# EAGLE design d150_zm1000_rev_a (EAGLE 6.1)
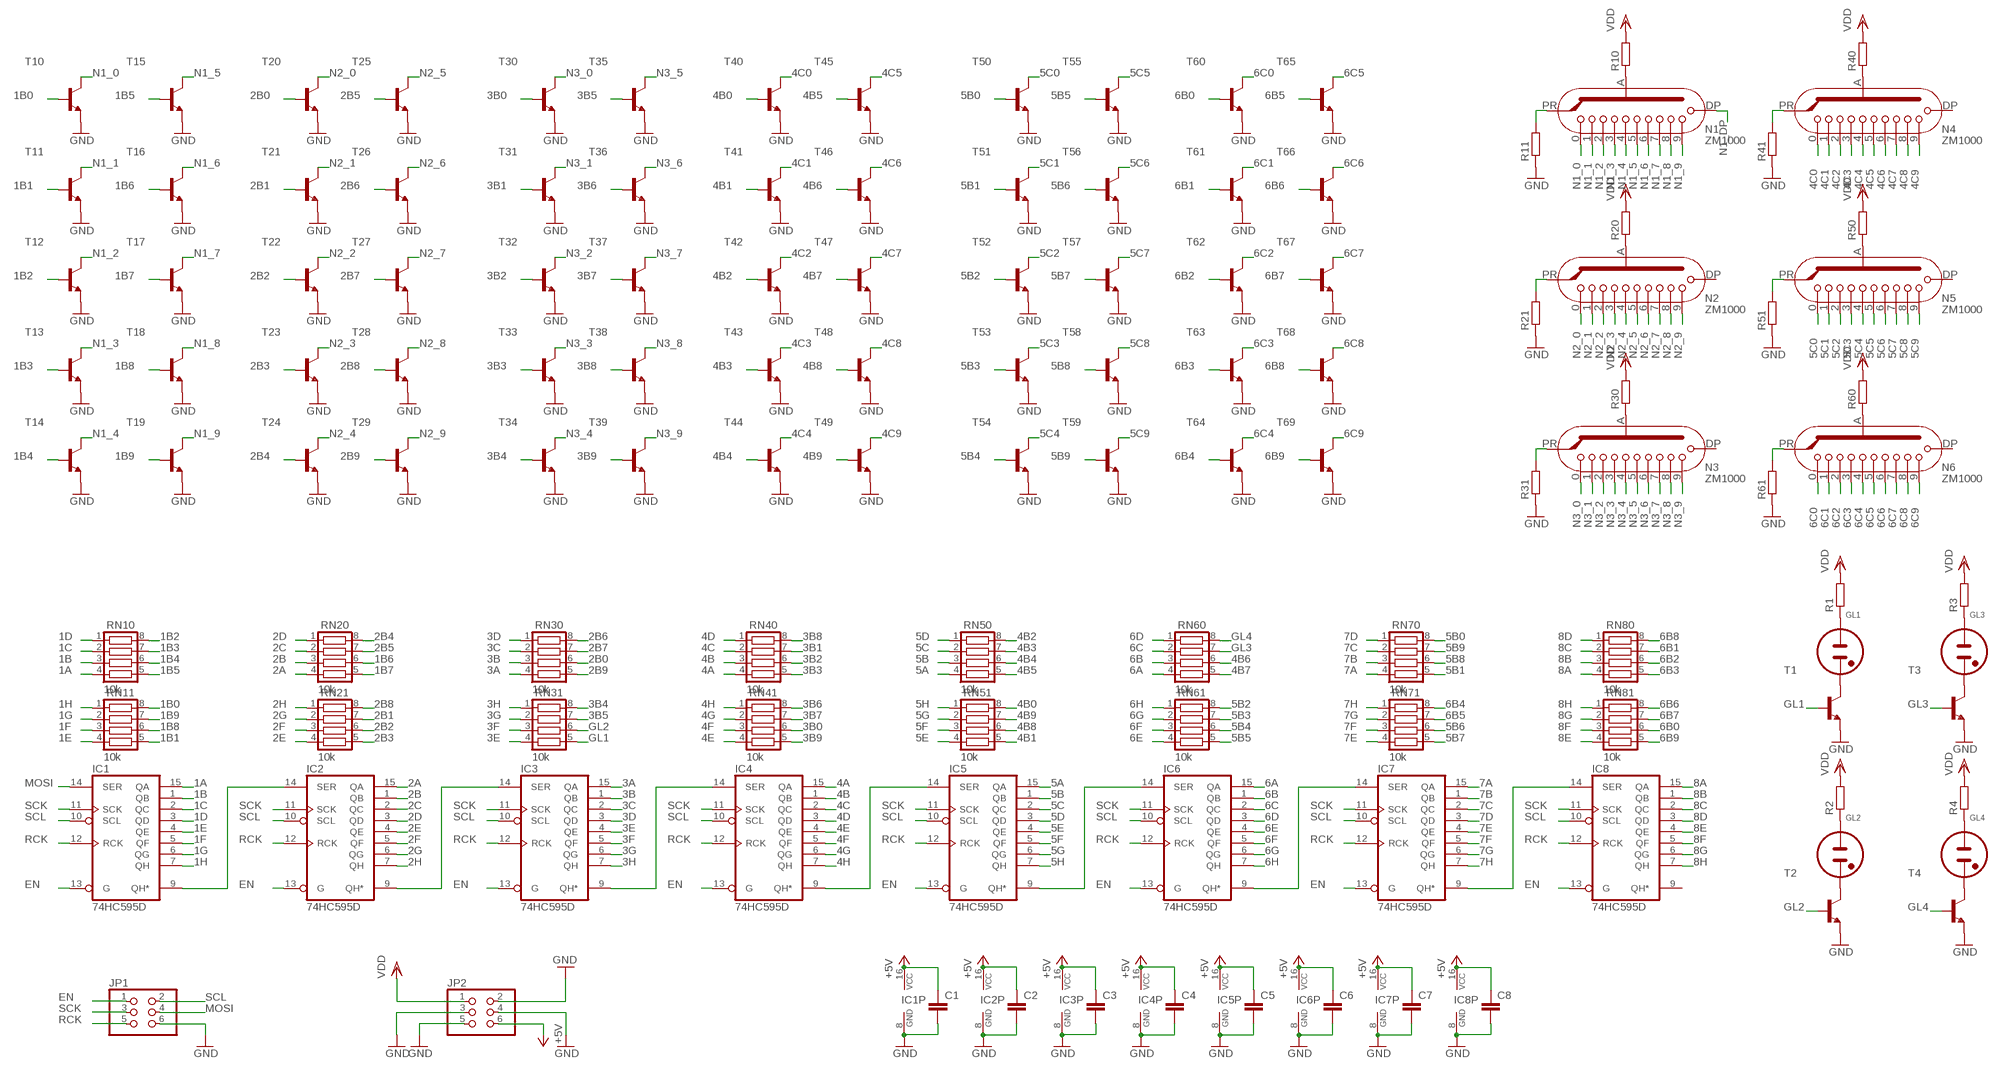
[diagram p0: schematic, sheet 1]

## Parts
C1  C-EUC0603  [C0603]
C2  C-EUC0603  [C0603]
C3  C-EUC0603  [C0603]
C4  C-EUC0603  [C0603]
C5  C-EUC0603  [C0603]
C6  C-EUC0603  [C0603]
C7  C-EUC0603  [C0603]
C8  C-EUC0603  [C0603]
GL1  NE2-NEON-BULB-DRILL  [NE2-NEON-BULB-DRILL]
GL2  NE2-NEON-BULB-DRILL  [NE2-NEON-BULB-DRILL]
GL3  NE2-NEON-BULB-DRILL  [NE2-NEON-BULB-DRILL]
GL4  NE2-NEON-BULB-DRILL  [NE2-NEON-BULB-DRILL]
IC1  74HC595D  [SO16]
IC2  74HC595D  [SO16]
IC3  74HC595D  [SO16]
IC4  74HC595D  [SO16]
IC5  74HC595D  [SO16]
IC6  74HC595D  [SO16]
IC7  74HC595D  [SO16]
IC8  74HC595D  [SO16]
JP1  PINHD-2X3_2.54-SMD  [2X03SMD]
JP2  PINHD-2X3_2.54-SMD  [2X03SMD]
N1  ZM1000  [ZM1000]
N2  ZM1000  [ZM1000]
N3  ZM1000  [ZM1000]
N4  ZM1000  [ZM1000]
N5  ZM1000  [ZM1000]
N6  ZM1000  [ZM1000]
R1  R-EU_R0603  [R0603]
R2  R-EU_R0603  [R0603]
R3  R-EU_R0603  [R0603]
R4  R-EU_R0603  [R0603]
R10  R-EU_R0603  [R0603]
R11  R-EU_R0603  [R0603]
R20  R-EU_R0603  [R0603]
R21  R-EU_R0603  [R0603]
R30  R-EU_R0603  [R0603]
R31  R-EU_R0603  [R0603]
R40  R-EU_R0603  [R0603]
R41  R-EU_R0603  [R0603]
R50  R-EU_R0603  [R0603]
R51  R-EU_R0603  [R0603]
R60  R-EU_R0603  [R0603]
R61  R-EU_R0603  [R0603]
RN10  10k  CTS742C083  [CTS742C083]
RN11  10k  CTS742C083  [CTS742C083]
RN20  10k  CTS742C083  [CTS742C083]
RN21  10k  CTS742C083  [CTS742C083]
RN30  10k  CTS742C083  [CTS742C083]
RN31  10k  CTS742C083  [CTS742C083]
RN40  10k  CTS742C083  [CTS742C083]
RN41  10k  CTS742C083  [CTS742C083]
RN50  10k  CTS742C083  [CTS742C083]
RN51  10k  CTS742C083  [CTS742C083]
RN60  10k  CTS742C083  [CTS742C083]
RN61  10k  CTS742C083  [CTS742C083]
RN70  10k  CTS742C083  [CTS742C083]
RN71  10k  CTS742C083  [CTS742C083]
RN80  10k  CTS742C083  [CTS742C083]
RN81  10k  CTS742C083  [CTS742C083]
T1  SMBTA42  [SOT23]
T2  SMBTA42  [SOT23]
T3  SMBTA42  [SOT23]
T4  SMBTA42  [SOT23]
T10  SMBTA42  [SOT23]
T11  SMBTA42  [SOT23]
T12  SMBTA42  [SOT23]
T13  SMBTA42  [SOT23]
T14  SMBTA42  [SOT23]
T15  SMBTA42  [SOT23]
T16  SMBTA42  [SOT23]
T17  SMBTA42  [SOT23]
T18  SMBTA42  [SOT23]
T19  SMBTA42  [SOT23]
T20  SMBTA42  [SOT23]
T21  SMBTA42  [SOT23]
T22  SMBTA42  [SOT23]
T23  SMBTA42  [SOT23]
T24  SMBTA42  [SOT23]
T25  SMBTA42  [SOT23]
T26  SMBTA42  [SOT23]
T27  SMBTA42  [SOT23]
T28  SMBTA42  [SOT23]
T29  SMBTA42  [SOT23]
T30  SMBTA42  [SOT23]
T31  SMBTA42  [SOT23]
T32  SMBTA42  [SOT23]
T33  SMBTA42  [SOT23]
T34  SMBTA42  [SOT23]
T35  SMBTA42  [SOT23]
T36  SMBTA42  [SOT23]
T37  SMBTA42  [SOT23]
T38  SMBTA42  [SOT23]
T39  SMBTA42  [SOT23]
T40  SMBTA42  [SOT23]
T41  SMBTA42  [SOT23]
T42  SMBTA42  [SOT23]
T43  SMBTA42  [SOT23]
T44  SMBTA42  [SOT23]
T45  SMBTA42  [SOT23]
T46  SMBTA42  [SOT23]
T47  SMBTA42  [SOT23]
T48  SMBTA42  [SOT23]
T49  SMBTA42  [SOT23]
T50  SMBTA42  [SOT23]
T51  SMBTA42  [SOT23]
T52  SMBTA42  [SOT23]
T53  SMBTA42  [SOT23]
T54  SMBTA42  [SOT23]
T55  SMBTA42  [SOT23]
T56  SMBTA42  [SOT23]
T57  SMBTA42  [SOT23]
T58  SMBTA42  [SOT23]
T59  SMBTA42  [SOT23]
T60  SMBTA42  [SOT23]
T61  SMBTA42  [SOT23]
T62  SMBTA42  [SOT23]
T63  SMBTA42  [SOT23]
T64  SMBTA42  [SOT23]
T65  SMBTA42  [SOT23]
T66  SMBTA42  [SOT23]
T67  SMBTA42  [SOT23]
T68  SMBTA42  [SOT23]
T69  SMBTA42  [SOT23]

## Nets
1A: IC1.15(QA) RN10.4
1B: IC1.1(QB) RN10.3
1B0: RN11.8 T10.1(B)
1B1: RN11.5 T11.1(B)
1B2: RN10.8 T12.1(B)
1B3: RN10.7 T13.1(B)
1B4: RN10.6 T14.1(B)
1B5: RN10.5 T15.1(B)
1B6: RN20.6 T16.1(B)
1B7: RN20.5 T17.1(B)
1B8: RN11.6 T18.1(B)
1B9: RN11.7 T19.1(B)
1C: IC1.2(QC) RN10.2
1D: IC1.3(QD) RN10.1
1E: IC1.4(QE) RN11.4
1F: IC1.5(QF) RN11.3
1G: IC1.6(QG) RN11.2
1H: IC1.7(QH) RN11.1
2A: IC2.15(QA) RN20.4
2B: IC2.1(QB) RN20.3
2B0: RN30.6 T20.1(B)
2B1: RN21.7 T21.1(B)
2B2: RN21.6 T22.1(B)
2B3: RN21.5 T23.1(B)
2B4: RN20.8 T24.1(B)
2B5: RN20.7 T25.1(B)
2B6: RN30.8 T26.1(B)
2B7: RN30.7 T27.1(B)
2B8: RN21.8 T28.1(B)
2B9: RN30.5 T29.1(B)
2C: IC2.2(QC) RN20.2
2D: IC2.3(QD) RN20.1
2E: IC2.4(QE) RN21.4
2F: IC2.5(QF) RN21.3
2G: IC2.6(QG) RN21.2
2H: IC2.7(QH) RN21.1
3A: IC3.15(QA) RN30.4
3B: IC3.1(QB) RN30.3
3B0: RN41.6 T30.1(B)
3B1: RN40.7 T31.1(B)
3B2: RN40.6 T32.1(B)
3B3: RN40.5 T33.1(B)
3B4: RN31.8 T34.1(B)
3B5: RN31.7 T35.1(B)
3B6: RN41.8 T36.1(B)
3B7: RN41.7 T37.1(B)
3B8: RN40.8 T38.1(B)
3B9: RN41.5 T39.1(B)
3C: IC3.2(QC) RN30.2
3D: IC3.3(QD) RN30.1
3E: IC3.4(QE) RN31.4
3F: IC3.5(QF) RN31.3
3G: IC3.6(QG) RN31.2
3H: IC3.7(QH) RN31.1
4A: IC4.15(QA) RN40.4
4B: IC4.1(QB) RN40.3
4B0: RN51.8 T40.1(B)
4B1: RN51.5 T41.1(B)
4B2: RN50.8 T42.1(B)
4B3: RN50.7 T43.1(B)
4B4: RN50.6 T44.1(B)
4B5: RN50.5 T45.1(B)
4B6: RN60.6 T46.1(B)
4B7: RN60.5 T47.1(B)
4B8: RN51.6 T48.1(B)
4B9: RN51.7 T49.1(B)
4C: IC4.2(QC) RN40.2
4C0: N4.K0 T40.3(C)
4C1: N4.K1 T41.3(C)
4C2: N4.K2 T42.3(C)
4C3: N4.K3 T43.3(C)
4C4: N4.K4 T44.3(C)
4C5: N4.K5 T45.3(C)
4C6: N4.K6 T46.3(C)
4C7: N4.K7 T47.3(C)
4C8: N4.K8 T48.3(C)
4C9: N4.K9 T49.3(C)
4D: IC4.3(QD) RN40.1
4E: IC4.4(QE) RN41.4
4F: IC4.5(QF) RN41.3
4G: IC4.6(QG) RN41.2
4H: IC4.7(QH) RN41.1
5A: IC5.15(QA) RN50.4
5B: IC5.1(QB) RN50.3
5B0: RN70.8 T50.1(B)
5B1: RN70.5 T51.1(B)
5B2: RN61.8 T52.1(B)
5B3: RN61.7 T53.1(B)
5B4: RN61.6 T54.1(B)
5B5: RN61.5 T55.1(B)
5B6: RN71.6 T56.1(B)
5B7: RN71.5 T57.1(B)
5B8: RN70.6 T58.1(B)
5B9: RN70.7 T59.1(B)
5C: IC5.2(QC) RN50.2
5C0: N5.K0 T50.3(C)
5C1: N5.K1 T51.3(C)
5C2: N5.K2 T52.3(C)
5C3: N5.K3 T53.3(C)
5C4: N5.K4 T54.3(C)
5C5: N5.K5 T55.3(C)
5C6: N5.K6 T56.3(C)
5C7: N5.K7 T57.3(C)
5C8: N5.K8 T58.3(C)
5C9: N5.K9 T59.3(C)
5D: IC5.3(QD) RN50.1
5E: IC5.4(QE) RN51.4
5F: IC5.5(QF) RN51.3
5G: IC5.6(QG) RN51.2
5H: IC5.7(QH) RN51.1
6A: IC6.15(QA) RN60.4
6B: IC6.1(QB) RN60.3
6B0: RN81.6 T60.1(B)
6B1: RN80.7 T61.1(B)
6B2: RN80.6 T62.1(B)
6B3: RN80.5 T63.1(B)
6B4: RN71.8 T64.1(B)
6B5: RN71.7 T65.1(B)
6B6: RN81.8 T66.1(B)
6B7: RN81.7 T67.1(B)
6B8: RN80.8 T68.1(B)
6B9: RN81.5 T69.1(B)
6C: IC6.2(QC) RN60.2
6C0: N6.K0 T60.3(C)
6C1: N6.K1 T61.3(C)
6C2: N6.K2 T62.3(C)
6C3: N6.K3 T63.3(C)
6C4: N6.K4 T64.3(C)
6C5: N6.K5 T65.3(C)
6C6: N6.K6 T66.3(C)
6C7: N6.K7 T67.3(C)
6C8: N6.K8 T68.3(C)
6C9: N6.K9 T69.3(C)
6D: IC6.3(QD) RN60.1
6E: IC6.4(QE) RN61.4
6F: IC6.5(QF) RN61.3
6G: IC6.6(QG) RN61.2
6H: IC6.7(QH) RN61.1
7A: IC7.15(QA) RN70.4
7B: IC7.1(QB) RN70.3
7C: IC7.2(QC) RN70.2
7D: IC7.3(QD) RN70.1
7E: IC7.4(QE) RN71.4
7F: IC7.5(QF) RN71.3
7G: IC7.6(QG) RN71.2
7H: IC7.7(QH) RN71.1
8A: IC8.15(QA) RN80.4
8B: IC8.1(QB) RN80.3
8C: IC8.2(QC) RN80.2
8D: IC8.3(QD) RN80.1
8E: IC8.4(QE) RN81.4
8F: IC8.5(QF) RN81.3
8G: IC8.6(QG) RN81.2
8H: IC8.7(QH) RN81.1
+5V: C1.1 C2.1 C3.1 C4.1 C5.1 C6.1 C7.1 C8.1 IC1.16(VCC) IC2.16(VCC) IC3.16(VCC) IC4.16(VCC) IC5.16(VCC) IC6.16(VCC) IC7.16(VCC) IC8.16(VCC) JP2.6
EN: IC1.13(G) IC2.13(G) IC3.13(G) IC4.13(G) IC5.13(G) IC6.13(G) IC7.13(G) IC8.13(G) JP1.1
GL1: RN31.5 T1.1(B)
GL2: RN31.6 T2.1(B)
GL3: RN60.7 T3.1(B)
GL4: RN60.8 T4.1(B)
GND: C1.2 C2.2 C3.2 C4.2 C5.2 C6.2 C7.2 C8.2 IC1.8(GND) IC2.8(GND) IC3.8(GND) IC4.8(GND) IC5.8(GND) IC6.8(GND) IC7.8(GND) IC8.8(GND) JP1.6 JP2.2 JP2.3 JP2.4 JP2.5 R11.1 R21.1 R31.1 R41.1 R51.1 R61.1 T1.2(E) T2.2(E) T3.2(E) T4.2(E) T10.2(E) T11.2(E) T12.2(E) T13.2(E) T14.2(E) T15.2(E) T16.2(E) T17.2(E) T18.2(E) T19.2(E) T20.2(E) T21.2(E) T22.2(E) T23.2(E) T24.2(E) T25.2(E) T26.2(E) T27.2(E) T28.2(E) T29.2(E) T30.2(E) T31.2(E) T32.2(E) T33.2(E) T34.2(E) T35.2(E) T36.2(E) T37.2(E) T38.2(E) T39.2(E) T40.2(E) T41.2(E) T42.2(E) T43.2(E) T44.2(E) T45.2(E) T46.2(E) T47.2(E) T48.2(E) T49.2(E) T50.2(E) T51.2(E) T52.2(E) T53.2(E) T54.2(E) T55.2(E) T56.2(E) T57.2(E) T58.2(E) T59.2(E) T60.2(E) T61.2(E) T62.2(E) T63.2(E) T64.2(E) T65.2(E) T66.2(E) T67.2(E) T68.2(E) T69.2(E)
MOSI: IC1.14(SER) JP1.4
N1_0: N1.K0 T10.3(C)
N1_1: N1.K1 T11.3(C)
N1_2: N1.K2 T12.3(C)
N1_3: N1.K3 T13.3(C)
N1_4: N1.K4 T14.3(C)
N1_5: N1.K5 T15.3(C)
N1_6: N1.K6 T16.3(C)
N1_7: N1.K7 T17.3(C)
N1_8: N1.K8 T18.3(C)
N1_9: N1.K9 T19.3(C)
N1_DP: N1.KDP(DP)
N1_PR: N1.PR R11.2
N2_0: N2.K0 T20.3(C)
N2_1: N2.K1 T21.3(C)
N2_2: N2.K2 T22.3(C)
N2_3: N2.K3 T23.3(C)
N2_4: N2.K4 T24.3(C)
N2_5: N2.K5 T25.3(C)
N2_6: N2.K6 T26.3(C)
N2_7: N2.K7 T27.3(C)
N2_8: N2.K8 T28.3(C)
N2_9: N2.K9 T29.3(C)
N3_0: N3.K0 T30.3(C)
N3_1: N3.K1 T31.3(C)
N3_2: N3.K2 T32.3(C)
N3_3: N3.K3 T33.3(C)
N3_4: N3.K4 T34.3(C)
N3_5: N3.K5 T35.3(C)
N3_6: N3.K6 T36.3(C)
N3_7: N3.K7 T37.3(C)
N3_8: N3.K8 T38.3(C)
N3_9: N3.K9 T39.3(C)
N$1: GL2.1(A) R2.1
N$2: GL3.1(A) R3.1
N$3: GL4.1(A) R4.1
N$4: N1.A1(A) N1.A2(A) R10.1
N$5: GL2.2(A1) T2.3(C)
N$6: GL1.2(A1) T1.3(C)
N$7: GL4.2(A1) T4.3(C)
N$8: GL3.2(A1) T3.3(C)
N$9: N2.A1(A) N2.A2(A) R20.1
N$10: IC1.9(QH*) IC2.14(SER)
N$11: IC2.9(QH*) IC3.14(SER)
N$12: IC3.9(QH*) IC4.14(SER)
N$13: N3.A1(A) N3.A2(A) R30.1
N$14: N4.A1(A) N4.A2(A) R40.1
N$15: N6.A1(A) N6.A2(A) R60.1
N$16: IC4.9(QH*) IC5.14(SER)
N$17: N5.A1(A) N5.A2(A) R50.1
N$18: IC5.9(QH*) IC6.14(SER)
N$19: IC6.9(QH*) IC7.14(SER)
N$20: IC7.9(QH*) IC8.14(SER)
N$21: GL1.1(A) R1.1
N$25: N6.PR R61.2
N$26: N3.PR R31.2
N$27: N2.PR R21.2
N$28: N5.PR R51.2
N$29: N4.PR R41.2
RCK: IC1.12(RCK) IC2.12(RCK) IC3.12(RCK) IC4.12(RCK) IC5.12(RCK) IC6.12(RCK) IC7.12(RCK) IC8.12(RCK) JP1.5
SCK: IC1.11(SCK) IC2.11(SCK) IC3.11(SCK) IC4.11(SCK) IC5.11(SCK) IC6.11(SCK) IC7.11(SCK) IC8.11(SCK) JP1.3
SCL: IC1.10(SCL) IC2.10(SCL) IC3.10(SCL) IC4.10(SCL) IC5.10(SCL) IC6.10(SCL) IC7.10(SCL) IC8.10(SCL) JP1.2
VDD: JP2.1 R1.2 R2.2 R3.2 R4.2 R10.2 R20.2 R30.2 R40.2 R50.2 R60.2
Unconnected: IC8.9(QH*) N2.KDP(DP) N3.KDP(DP) N4.KDP(DP) N5.KDP(DP) N6.KDP(DP)

## Library data of the parts
C1-C8 = rcl:C-EU: CAPACITOR, European symbol
GL1-GL4 = nixie_tube:NE2-NEON-BULB: Neon indicator (wire connection)
IC1-IC8 = 74xx-eu:74*595: 8-bit SHIFT REGISTER, output latch
JP1 JP2 = con-pinhead:PINHD-2X3: PIN HEADER
N1-N6 = nixietubes-western:ZM1000
R1-R4 R10 R11 R20 R21 R30 R31 R40 R41 R50 R51 R60 R61 = rcl:R-EU_: RESISTOR, European symbol
RN10 RN11 RN20 RN21 RN30 RN31 RN40 RN41 RN50 RN51 RN60 RN61 RN70 RN71 RN80 RN81 = resistor-net:CTS742C083: Chip Resistor Array 4 Single Resistor Source: http://www.ctscorp.com/components/Datasheets/CTSChipArrayDs.pdf; OC_FARNELL: unknown; OC_NEWARK: unknown
T1-T4 T10-T69 = transistor-hv:SMBTA42

## Board
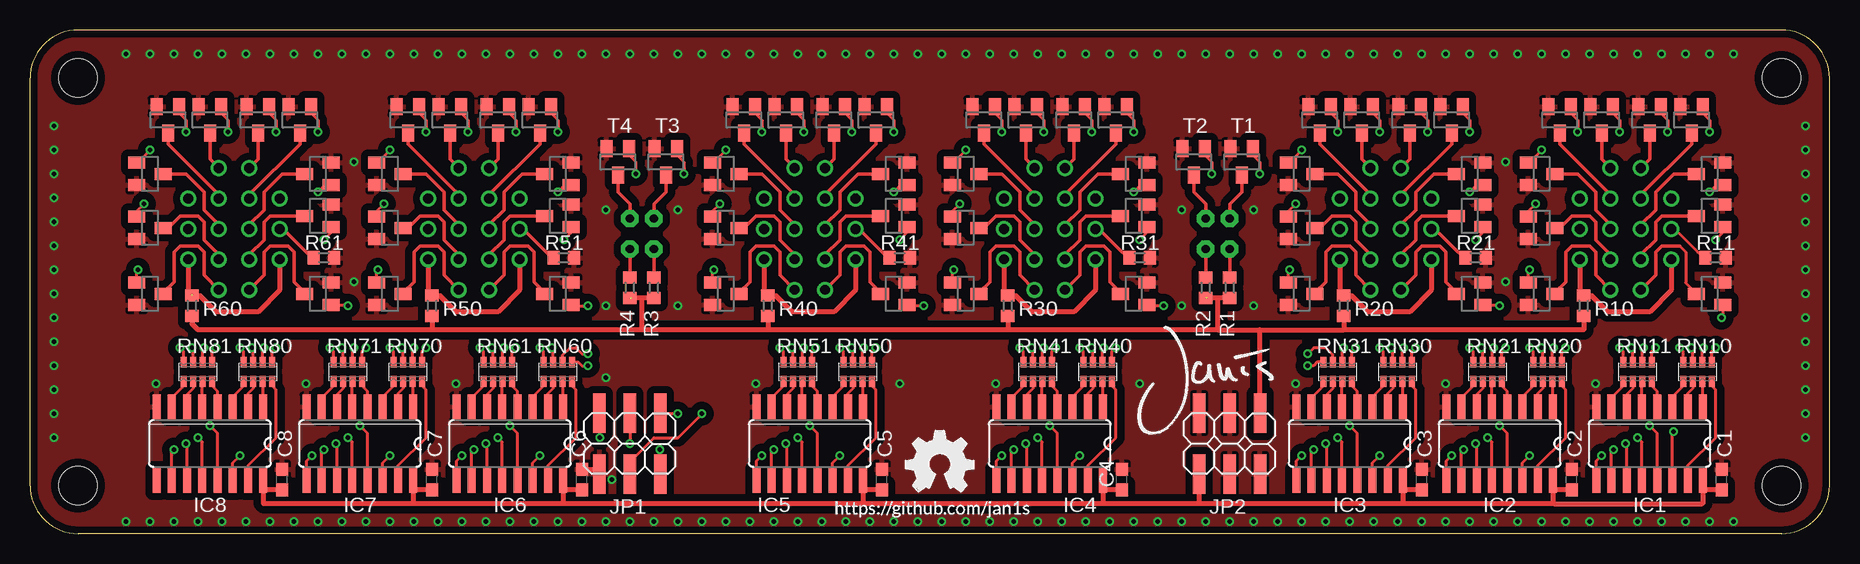
[diagram p1: board, top side]
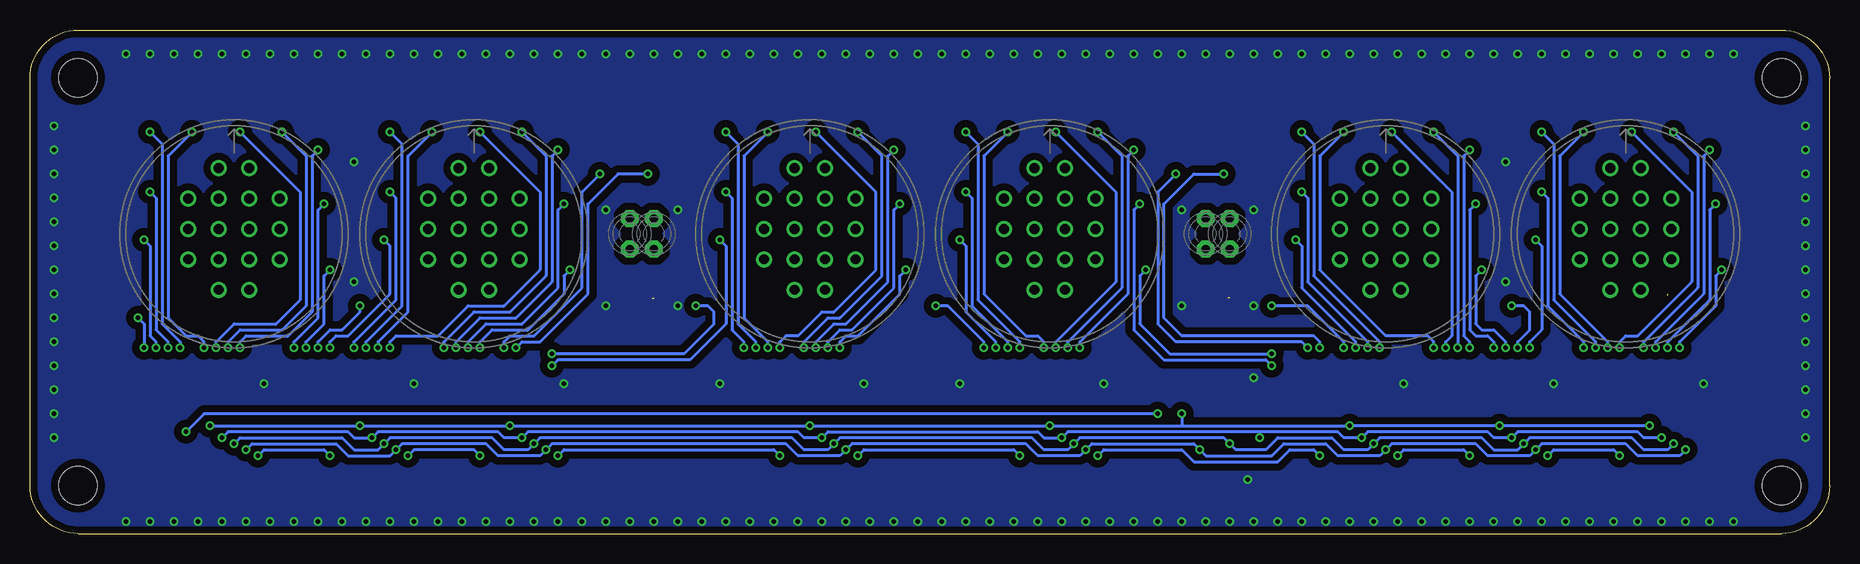
[diagram p2: board, bottom side, seen from below]

Size 150 x 42 mm. Coordinates in mm from the lower left corner, seen from the top.
Outline: 146,0 4,0 arc-90 0,4 0,38 arc-90 4,42 146,42 arc-90 150,38 150,4 arc-90 146,0
Copper layers (1*16): Top 0.035mm / dielectric 1.5mm / Bottom 0.035mm
Design rules: minimum track width 6mil, minimum drill 12mil, track to track 6mil, track to pad 6mil, pad to pad 6mil, via to via 6mil, smd to smd 0mil, copper to edge 10mil, drill to drill 10mil, minimum pad ring 10mil, minimum via ring 6mil, stop-mask expansion 2mil, vias tented up to drill 100mil, thermal gap 10mil
Holes 3.2 mm at 146,4 146,38 4,38 4,4

### Footprints (pad centres in the part's own frame; a part is rotated, then mirrored left to right if it is on the bottom)
C0603 = smd 1.1 x 1: 1 -0.85,0; 2 0.85,0
NE2-NEON-BULB-DRILL = drill 0.7 pad 1.422 octagon: 1 0,1.27; 2 0,-1.27
SO16 = smd 0.66 x 2.032: 1 -4.445,-3.073; 2 -3.175,-3.073; 3 -1.905,-3.073; 4 -0.635,-3.073; 5 0.635,-3.073; 6 1.905,-3.073; 7 3.175,-3.073; 8 4.445,-3.073; 9 4.445,3.073; 10 3.175,3.073; 11 1.905,3.073; 12 0.635,3.073; 13 -0.635,3.073; 14 -1.905,3.073; 15 -3.175,3.073; 16 -4.445,3.073
2X03SMD = smd 1.016 x 3.302: 1 -2.54,-2.54; 2 -2.54,2.54; 3 0,-2.54; 4 0,2.54; 5 2.54,-2.54; 6 2.54,2.54
ZM1000 = drill 0.8: A1 -3.81,-2.14; A2 3.81,-2.14; IC1 -3.81,2.94; IC2 3.81,2.94; K0 1.27,0.4; K1 -1.27,5.48; K2 -1.27,2.94; K3 -1.27,0.4; K4 -1.27,-2.14; K5 -1.27,-4.68; K6 1.27,-4.68; K7 1.27,-2.14; K8 1.27,5.48; K9 1.27,2.94; KDP 3.81,0.4; PR -3.81,0.4
R0603 = smd 1 x 1.1: 1 -0.85,0; 2 0.85,0
CTS742C083 = smd 0.5 x 0.9: 1 -1.2,-0.8; 2 -0.4,-0.8; 3 0.4,-0.8; 4 1.2,-0.8; 5 1.2,0.8; 6 0.4,0.8; 7 -0.4,0.8; 8 -1.2,0.8
SOT23 = smd 1 x 1.4: 1 -0.95,-1.1; 2 0.95,-1.1; 3 0,1.1

### Placement (x,y rotation side)
C1  141,4.5 90 top
C2  128.5,4.5 90 top
C3  116,4.5 90 top
C4  91,4.5 90 top
C5  71,4.5 90 top
C6  46,4.5 90 top
C7  33.5,4.5 90 top
C8  21,4.5 90 top
GL1  100,25 180 bottom
GL2  98,25 180 bottom
GL3  52,25 180 bottom
GL4  50,25 180 bottom
IC1  135,7.5 180 top
IC2  122.5,7.5 180 top
IC3  110,7.5 180 top
IC4  85,7.5 180 top
IC5  65,7.5 180 top
IC6  40,7.5 180 top
IC7  27.5,7.5 180 top
IC8  15,7.5 180 top
JP1  50,7.5 180 top
JP2  100,7.5 180 top
N1  133,25 0 bottom
N2  113,25 0 bottom
N3  85,25 0 bottom
N4  65,25 0 bottom
N5  37,25 0 bottom
N6  17,25 0 bottom
R1  100,20.5 270 top
R2  98,20.5 270 top
R3  52,20.5 270 top
R4  50,20.5 270 top
R10  129.5,19 270 top
R11  140.5,23 180 top
R20  109.5,19 270 top
R21  120.5,23 180 top
R30  81.5,19 270 top
R31  92.5,23 180 top
R40  61.5,19 270 top
R41  72.5,23 180 top
R50  33.5,19 270 top
R51  44.5,23 180 top
R60  13.5,19 270 top
R61  24.5,23 180 top
RN10  139,13.5 0 top
RN11  134,13.5 0 top
RN20  126.5,13.5 0 top
RN21  121.5,13.5 0 top
RN30  114,13.5 0 top
RN31  109,13.5 0 top
RN40  89,13.5 0 top
RN41  84,13.5 0 top
RN50  69,13.5 0 top
RN51  64,13.5 0 top
RN60  44,13.5 0 top
RN61  39,13.5 0 top
RN70  31.5,13.5 0 top
RN71  26.5,13.5 0 top
RN80  19,13.5 0 top
RN81  14,13.5 0 top
T1  101,31 180 top
T2  97,31 180 top
T3  53,31 180 top
T4  49,31 180 top
T10  126,30 270 top
T11  135,34.5 180 top
T12  138.5,34.5 180 top
T13  140,30 90 top
T14  140,26.5 90 top
T15  140,20 90 top
T16  126,20 270 top
T17  126,25.5 270 top
T18  131,34.5 180 top
T19  127.5,34.5 180 top
T20  106,30 270 top
T21  115,34.5 180 top
T22  118.5,34.5 180 top
T23  120,30 90 top
T24  120,26.5 90 top
T25  120,20 90 top
T26  106,20 270 top
T27  106,25.5 270 top
T28  111,34.5 180 top
T29  107.5,34.5 180 top
T30  78,30 270 top
T31  87,34.5 180 top
T32  90.5,34.5 180 top
T33  92,30 90 top
T34  92,26.5 90 top
T35  92,20 90 top
T36  78,20 270 top
T37  78,25.5 270 top
T38  83,34.5 180 top
T39  79.5,34.5 180 top
T40  58,30 270 top
T41  67,34.5 180 top
T42  70.5,34.5 180 top
T43  72,30 90 top
T44  72,26.5 90 top
T45  72,20 90 top
T46  58,20 270 top
T47  58,25.5 270 top
T48  63,34.5 180 top
T49  59.5,34.5 180 top
T50  30,30 270 top
T51  39,34.5 180 top
T52  42.5,34.5 180 top
T53  44,30 90 top
T54  44,26.5 90 top
T55  44,20 90 top
T56  30,20 270 top
T57  30,25.5 270 top
T58  35,34.5 180 top
T59  31.5,34.5 180 top
T60  10,30 270 top
T61  19,34.5 180 top
T62  22.5,34.5 180 top
T63  24,30 90 top
T64  24,26.5 90 top
T65  24,20 90 top
T66  10,20 270 top
T67  10,25.5 270 top
T68  15,34.5 180 top
T69  11.5,34.5 180 top
U$1  [GITHUB/JAN1S]  67,1.5 0 top
U$2  [JANIS_10MM]  92,8 0 top
U$3  [OSHW_FILLX200_NOTEXT]  73,3.5 0 top

### Tracks (layer width: path | path; a pad name or v marks a point on that pad's centre or on a via)
1A
  Top 0.254: IC1.15 138.18,5.67 140.5,8 140.5,12 140.2,12.3 RN10.4
1B
  Top 0.254: IC1.1 139.44,12.65 RN10.3
1B0  (via drill 0.4)
  Top 0.254: RN11.8 132.8,15.2 v132.5,15.5 | T10.1 124.95,30.95 v126,32
  Bottom 0.254: v132.5,15.5 132.5,16 132,16.5 128.5,16.5 126.5,18.5 126.5,31.5 v126,32
1B1  (via drill 0.4)
  Top 0.254: T11.1 135.95,35.05 136.5,34.5 v136.5,33.5 | RN11.5 135.2,15.2 v135.5,15.5
  Bottom 0.254: v136.5,33.5 138.5,31.5 138.5,18 137,16.5 136,16.5 135.5,16 v135.5,15.5
1B2  (via drill 0.4)
  Top 0.254: T12.1 139.45,35.05 140,34.5 v140,33.5 | RN10.8 137.8,15.2 v137.5,15.5
  Bottom 0.254: v140,33.5 139,32.5 139,17.5 137.5,16 v137.5,15.5
1B3  (via drill 0.4)
  Top 0.254: RN10.7 138.6,15.4 v138.5,15.5 | T13.1 140.55,29.05 v140,28.5
  Bottom 0.254: v138.5,15.5 138.5,16 139.5,17 139.5,28 v140,28.5
1B4  (via drill 0.4)
  Top 0.254: RN10.6 139.4,15.4 v139.5,15.5 | T14.1 141.1,25.1 v140.5,24.5
  Bottom 0.254: v139.5,15.5 139.5,16 140,16.5 140,24 v140.5,24.5
1B5  (via drill 0.4)
  Top 0.254: RN10.5 140.2,15.2 v140.5,15.5 | T15.1 141.1,18.1 v141,18
  Bottom 0.254: v141,18 140.5,17.5 v140.5,15.5
1B6  (via drill 0.4)
  Top 0.254: RN20.6 126.9,15.4 v127,15.5 | T16.1 124.9,21.9 v125,22
  Bottom 0.254: v127,15.5 127,16 125.5,17.5 125.5,21.5 v125,22
1B7  (via drill 0.4)
  Top 0.254: RN20.5 127.7,15.2 v128,15.5 | T17.1 124.9,26.9 v125.5,27.5
  Bottom 0.254: v125.5,27.5 126,27 126,18 128,16 v128,15.5
1B8  (via drill 0.4)
  Top 0.254: T18.1 131.95,35.05 132.5,34.5 v132.5,33.5 | RN11.6 134.4,15.4 v134.5,15.5
  Bottom 0.254: v132.5,33.5 127.5,28.5 127.5,19.5 129.5,17.5 133,17.5 134.5,16 v134.5,15.5
1B9  (via drill 0.4)
  Top 0.254: T19.1 128.45,35.05 129,34.5 v129,33.5 | RN11.7 133.6,15.4 v133.5,15.5
  Bottom 0.254: v129,33.5 127,31.5 127,19 129,17 132.5,17 133.5,16 v133.5,15.5
1C
  Top 0.254: IC1.2 138.18,11.68 138.6,12.1 RN10.2
1D
  Top 0.254: IC1.3 136.91,11.4 137.8,12.3 RN10.1
1E
  Top 0.254: IC1.4 135.63,11.87 135.2,12.3 RN11.4
1F
  Top 0.254: IC1.5 134.37,12.66 RN11.3
1G
  Top 0.254: IC1.6 133.09,11.6 133.6,12.1 RN11.2
1H
  Top 0.254: IC1.7 131.82,11.32 132.8,12.3 RN11.1
2A
  Top 0.254: RN20.4 127.7,12.3 128,12 128,8 125.67,5.67 IC2.15
2B
  Top 0.254: IC2.1 126.94,12.65 RN20.3
2B0  (via drill 0.4)
  Top 0.254: RN30.6 114.4,15.4 v114.5,15.5 | T20.1 104.95,30.95 v106,32
  Bottom 0.254: v114.5,15.5 114.5,16 112.5,18 109.5,18 106.5,21 106.5,31.5 v106,32
2B1  (via drill 0.4)
  Top 0.254: T21.1 115.95,35.05 116.5,34.5 v116.5,33.5 | RN21.7 121.1,15.4 v121,15.5
  Bottom 0.254: v116.5,33.5 118.5,31.5 118.5,18.5 121,16 v121,15.5
2B2  (via drill 0.4)
  Top 0.254: T22.1 119.45,35.05 120,34.5 v120,33.5 | RN21.6 121.9,15.4 v122,15.5
  Bottom 0.254: v120,33.5 119,32.5 119,19 122,16 v122,15.5
2B3  (via drill 0.4)
  Top 0.254: T23.1 120.55,29.05 v120,28.5 | RN21.5 122.7,15.2 v123,15.5
  Bottom 0.254: v123,15.5 123,16 119.5,19.5 119.5,28 v120,28.5
2B4  (via drill 0.4)
  Top 0.254: RN20.8 125.3,15.2 v125,15.5 | T24.1 121.1,25.1 v120.5,24.5
  Bottom 0.254: v125,15.5 125,16 124.5,16.5 123.5,16.5 120,20 120,24 v120.5,24.5
2B5  (via drill 0.4)
  Top 0.254: 121.1,19.1 T25.1 122.45,19.05 v122.5,19 | RN20.7 126.1,15.4 v126,15.5
  Bottom 0.254: v126,15.5 126,16 125,17 124,17 122.5,18.5 v122.5,19
2B6  (via drill 0.4)
  Top 0.254: RN30.8 112.8,15.2 v112.5,15.5 | T26.1 104.9,21.9 v105,22
  Bottom 0.254: v112.5,15.5 112.5,16 111.5,17 108.5,17 105.5,20 105.5,21.5 v105,22
2B7  (via drill 0.4)
  Top 0.254: RN30.7 113.6,15.4 v113.5,15.5 | T27.1 104.9,26.9 v105.5,27.5
  Bottom 0.254: v113.5,15.5 113.5,16 112,17.5 109,17.5 106,20.5 106,27 v105.5,27.5
2B8  (via drill 0.4)
  Top 0.254: T28.1 111.95,35.05 112.5,34.5 v112.5,33.5 | RN21.8 120.3,15.2 v120,15.5
  Bottom 0.254: v112.5,33.5 107.5,28.5 107.5,22 110.5,19 113.5,19 116,16.5 119.5,16.5 120,16 v120,15.5
2B9  (via drill 0.4)
  Top 0.254: T29.1 108.45,35.05 109,34.5 v109,33.5 | RN30.5 115.2,15.2 v115.5,15.5
  Bottom 0.254: v109,33.5 107,31.5 107,21.5 110,18.5 113,18.5 115.5,16 v115.5,15.5
2C
  Top 0.254: IC2.2 125.67,11.68 126.1,12.1 RN20.2
2D
  Top 0.254: IC2.3 124.41,11.4 125.3,12.3 RN20.1
2E
  Top 0.254: IC2.4 123.14,11.87 122.7,12.3 RN21.4
2F
  Top 0.254: IC2.5 121.86,12.66 RN21.3
2G
  Top 0.254: IC2.6 120.59,11.6 121.1,12.1 RN21.2
2H
  Top 0.254: IC2.7 119.33,11.32 120.3,12.3 RN21.1
3A
  Top 0.254: IC3.15 113.17,5.67 115.5,8 115.5,12 115.2,12.3 RN30.4
3B
  Top 0.254: IC3.1 114.44,12.65 RN30.3
3B0  (via drill 0.4)
  Top 0.254: T30.1 76.95,30.95 v78,32 | RN41.6 84.4,15.4 v84.5,15.5
  Bottom 0.254: v78,32 78.5,31.5 78.5,21 82,17.5 83,17.5 84.5,16 v84.5,15.5
3B1  (via drill 0.4)
  Top 0.254: T31.1 87.95,35.05 88.5,34.5 v88.5,33.5 | RN40.7 88.6,15.4 v88.5,15.5
  Bottom 0.254: v88.5,33.5 90.5,31.5 90.5,18 88.5,16 v88.5,15.5
3B2  (via drill 0.4)
  Top 0.254: T32.1 91.45,35.05 92,34.5 v92,33.5 | RN40.6 89.4,15.4 v89.5,15.5
  Bottom 0.254: v92,33.5 91,32.5 91,17.5 89.5,16 v89.5,15.5
3B3  (via drill 0.4)
  Top 0.254: T33.1 92.55,29.05 v92,28.5 | RN40.5 90.2,15.2 v90.5,15.5
  Bottom 0.254: v92,28.5 91.5,28 91.5,17 90.5,16 v90.5,15.5
3B4  (via drill 0.4)
  Top 0.254: T34.1 93.1,25.1 v92.5,24.5 | RN31.8 107.3,14.3 107,14 v106.5,14
  Bottom 0.254: v92.5,24.5 92,24 92,17.5 95,14.5 106,14.5 v106.5,14
3B5  (via drill 0.4)
  Top 0.254: RN31.7 108.6,14.9 108,15.5 107,15.5 v106.5,15 | v94.5,19 93.15,19 T35.1
  Bottom 0.254: v106.5,15 95.5,15 93,17.5 93,18.5 93.5,19 v94.5,19
3B6  (via drill 0.4)
  Top 0.254: T36.1 76.9,21.9 v77,22 | RN41.8 82.8,15.2 v82.5,15.5
  Bottom 0.254: v77,22 77.5,21.5 77.5,20 81,16.5 82,16.5 82.5,16 v82.5,15.5
3B7  (via drill 0.4)
  Top 0.254: T37.1 76.9,26.9 v77.5,27.5 | RN41.7 83.6,15.4 v83.5,15.5
  Bottom 0.254: v77.5,27.5 78,27 78,20.5 81.5,17 82.5,17 83.5,16 v83.5,15.5
3B8  (via drill 0.4)
  Top 0.254: T38.1 83.95,35.05 84.5,34.5 v84.5,33.5 | RN40.8 87.8,15.2 v87.5,15.5
  Bottom 0.254: v84.5,33.5 79.5,28.5 79.5,22 83,18.5 84,18.5 86,16.5 87,16.5 87.5,16 v87.5,15.5
3B9  (via drill 0.4)
  Top 0.254: T39.1 80.45,35.05 81,34.5 v81,33.5 | RN41.5 85.2,15.2 v85.5,15.5
  Bottom 0.254: v81,33.5 79,31.5 79,21.5 82.5,18 83.5,18 85.5,16 v85.5,15.5
3C
  Top 0.254: IC3.2 113.17,11.68 113.6,12.1 RN30.2
3D
  Top 0.254: IC3.3 111.91,11.4 112.8,12.3 RN30.1
3E
  Top 0.254: IC3.4 110.64,11.87 110.2,12.3 RN31.4
3F
  Top 0.254: IC3.5 109.36,12.66 RN31.3
3G
  Top 0.254: IC3.6 108.09,11.6 108.6,12.1 RN31.2
3H
  Top 0.254: IC3.7 106.83,11.32 107.8,12.3 RN31.1
4A
  Top 0.254: IC4.15 88.17,5.67 90.5,8 90.5,12 90.2,12.3 RN40.4
4B
  Top 0.254: IC4.1 89.44,12.45 89.5,12.5 89.5,12.6 RN40.3
4B0  (via drill 0.4)
  Top 0.254: T40.1 56.95,30.95 v58,32 | RN51.8 62.8,15.2 v62.5,15.5
  Bottom 0.254: v58,32 58.5,31.5 58.5,20 62.5,16 v62.5,15.5
4B1  (via drill 0.4)
  Top 0.254: T41.1 67.95,35.05 68.5,34.5 v68.5,33.5 | RN51.5 65.2,15.2 v65.5,15.5
  Bottom 0.254: v68.5,33.5 70.5,31.5 70.5,20 67,16.5 66,16.5 65.5,16 v65.5,15.5
4B2  (via drill 0.4)
  Top 0.254: T42.1 71.45,35.05 72,34.5 v72,33.5 | RN50.8 67.8,15.2 v67.5,15.5
  Bottom 0.254: v72,33.5 71,32.5 71,19.5 67.5,16 v67.5,15.5
4B3  (via drill 0.4)
  Top 0.254: T43.1 72.55,29.05 v72,28.5 | RN50.7 68.6,15.4 v68.5,15.5
  Bottom 0.254: v72,28.5 71.5,28 71.5,19 68.5,16 v68.5,15.5
4B4  (via drill 0.4)
  Top 0.254: T44.1 73.1,25.1 v72.5,24.5 | RN50.6 69.4,15.4 v69.5,15.5
  Bottom 0.254: v72.5,24.5 72,24 72,18.5 69.5,16 v69.5,15.5
4B5  (via drill 0.4)
  Top 0.254: RN50.5 70.2,15.2 v70.5,15.5 | v74.5,19 73.15,19 T45.1
  Bottom 0.254: v70.5,15.5 70.5,16 73.5,19 v74.5,19
4B6  (via drill 0.4)
  Top 0.254: T46.1 56.9,21.9 v57,22 | RN60.6 44.4,14.9 45,15.5 45.5,15.5 46,15 v46.5,15
  Bottom 0.254: v57,22 57.5,21.5 57.5,17.5 55,15 v46.5,15
4B7  (via drill 0.4)
  Top 0.254: T47.1 56.9,26.9 v57.5,27.5 | RN60.5 45.7,14.3 46,14 v46.5,14
  Bottom 0.254: v57.5,27.5 58,27 58,17 55.5,14.5 47,14.5 v46.5,14
4B8  (via drill 0.4)
  Top 0.254: T48.1 63.95,35.05 64.5,34.5 v64.5,33.5 | RN51.6 64.4,15.4 v64.5,15.5
  Bottom 0.254: v64.5,33.5 59.5,28.5 59.5,21 64.5,16 v64.5,15.5
4B9  (via drill 0.4)
  Top 0.254: T49.1 60.45,35.05 61,34.5 v61,33.5 | RN51.7 63.6,15.4 v63.5,15.5
  Bottom 0.254: v61,33.5 59,31.5 59,20.5 63.5,16 v63.5,15.5
4C
  Top 0.254: IC4.2 88.17,11.68 88.6,12.1 RN40.2
4C0
  Top 0.305: T40.3 61,30 62.5,28.5 62.5,27 63.73,25.77 N4.K0
4C1
  Top 0.305: T41.3 67,31.21 N4.K1
4C2
  Top 0.305: T42.3 70.5,32.5 66.27,28.27 N4.K2
4C3
  Top 0.305: T43.3 69,30 67.5,28.5 67.5,27 66.27,25.77 N4.K3
4C4
  Top 0.305: T44.3 68,26.5 67.5,26 67.5,24.5 66.27,23.27 N4.K4
4C5
  Top 0.305: T45.3 70.9,20.1 70,21 70,23.5 69.5,24 68,24 67.5,23.5 67.5,21.55 N4.K5
4C6
  Top 0.305: T46.3 59.1,20.1 60,21 60,23.5 60.5,24 62,24 62.5,23.5 62.5,21.55 N4.K6
4C7
  Top 0.305: N4.K7 63.73,23.27 62.5,24.5 62.5,26 62,26.5 60.5,26.5 59.5,25.5 T47.3
4C8
  Top 0.305: T48.3 63,31.21 N4.K8
4C9
  Top 0.305: T49.3 59.5,32.5 63.73,28.27 N4.K9
4D
  Top 0.254: IC4.3 86.91,11.4 87.8,12.3 RN40.1
4E
  Top 0.254: IC4.4 85.64,11.87 85.2,12.3 RN41.4
4F
  Top 0.254: IC4.5 84.36,12.66 RN41.3
4G
  Top 0.254: IC4.6 83.09,11.6 83.6,12.1 RN41.2
4H
  Top 0.254: IC4.7 81.83,11.32 82.8,12.3 RN41.1
5A
  Top 0.254: IC5.15 68.17,5.67 70.5,8 70.5,12 70.2,12.3 RN50.4
5B
  Top 0.254: IC5.1 69.44,12.65 RN50.3
5B0  (via drill 0.4)
  Top 0.254: T50.1 28.95,30.95 v30,32 | RN70.8 30.3,15.2 v30,15.5
  Bottom 0.254: v30,32 30.5,31.5 30.5,16.5 30,16 v30,15.5
5B1  (via drill 0.4)
  Top 0.254: T51.1 39.95,35.05 40.5,34.5 v40.5,33.5 | RN70.5 32.7,15.2 v33,15.5
  Bottom 0.254: v40.5,33.5 42.5,31.5 42.5,22 37,16.5 33.5,16.5 33,16 v33,15.5
5B2  (via drill 0.4)
  Top 0.254: T52.1 43.45,35.05 44,34.5 v44,33.5 | RN61.8 37.8,15.2 v37.5,15.5
  Bottom 0.254: v44,33.5 43,32.5 43,21.5 37.5,16 v37.5,15.5
5B3  (via drill 0.4)
  Top 0.254: 44.55,29.05 v44,28.5 | RN61.7 38.6,15.4 v38.5,15.5
  Top 0.305: T53.1 44.55,29.05
  Bottom 0.254: v44,28.5 43.5,28 43.5,21 38.5,16 v38.5,15.5
5B4  (via drill 0.4)
  Top 0.254: T54.1 45.1,25.1 v44.5,24.5 | RN61.6 39.4,15.4 v39.5,15.5
  Bottom 0.254: v44.5,24.5 44,24 44,20.5 39.5,16 v39.5,15.5
5B5  (via drill 0.4)
  Top 0.254: 45.1,19.1 T55.1 45.15,19 v46.5,19 | RN61.5 40.2,15.2 v40.5,15.5
  Bottom 0.254: v40.5,15.5 40.5,16 43.5,19 v46.5,19
5B6  (via drill 0.4)
  Top 0.254: T56.1 28.9,21.9 v29,22 | RN71.6 26.9,15.4 v27,15.5
  Bottom 0.254: v29,22 29.5,21.5 29.5,17.5 29,17 28,17 27,16 v27,15.5
5B7  (via drill 0.4)
  Top 0.254: T57.1 28.9,26.9 v29.5,27.5 | RN71.5 27.7,15.2 v28,15.5
  Bottom 0.254: v29.5,27.5 30,27 30,17 29.5,16.5 28.5,16.5 28,16 v28,15.5
5B8  (via drill 0.4)
  Top 0.254: T58.1 35.95,35.05 36.5,34.5 v36.5,33.5 | RN70.6 31.9,15.4 v32,15.5
  Bottom 0.254: v36.5,33.5 31.5,28.5 31.5,16.5 32,16 v32,15.5
5B9  (via drill 0.4)
  Top 0.254: T59.1 32.45,35.05 33,34.5 v33,33.5 | RN70.7 31.1,15.4 v31,15.5
  Bottom 0.254: v33,33.5 31,31.5 v31,15.5
5C
  Top 0.254: IC5.2 68.17,11.68 68.6,12.1 RN50.2
5C0
  Top 0.305: T50.3 33,30 34.5,28.5 34.5,27 35.73,25.77 N5.K0
5C1
  Top 0.305: T51.3 39,31.21 N5.K1
5C2
  Top 0.305: T52.3 42.5,32.5 38.27,28.27 N5.K2
5C3
  Top 0.305: T53.3 41,30 39.5,28.5 39.5,27 38.27,25.77 N5.K3
5C4
  Top 0.305: T54.3 40,26.5 39.5,26 39.5,24.5 38.27,23.27 N5.K4
5C5
  Top 0.305: T55.3 42.9,20.1 42,21 42,23.5 41.5,24 40,24 39.5,23.5 39.5,21.55 N5.K5
5C6
  Top 0.305: T56.3 31.1,20.1 32,21 32,23.5 32.5,24 34,24 34.5,23.5 34.5,21.55 N5.K6
5C7
  Top 0.305: N5.K7 35.73,23.27 34.5,24.5 34.5,26 34,26.5 32.5,26.5 31.5,25.5 T57.3
5C8
  Top 0.305: T58.3 35,31.21 N5.K8
5C9
  Top 0.305: T59.3 31.5,32.5 35.73,28.27 N5.K9
5D
  Top 0.254: IC5.3 66.91,11.4 67.8,12.3 RN50.1
5E
  Top 0.254: IC5.4 65.64,11.87 65.2,12.3 RN51.4
5F
  Top 0.254: IC5.5 64.36,12.66 RN51.3
5G
  Top 0.254: IC5.6 63.09,11.6 63.6,12.1 RN51.2
5H
  Top 0.254: IC5.7 61.83,11.32 62.8,12.3 RN51.1
6A
  Top 0.254: IC6.15 43.17,5.67 45.5,8 45.5,12 45.2,12.3 RN60.4
6B
  Top 0.254: IC6.1 44.45,12.65 RN60.3
6B0  (via drill 0.4)
  Top 0.254: T60.1 8.95,30.95 v10,32 | RN81.6 14.4,15.4 v14.5,15.5
  Bottom 0.254: v10,32 10.5,31.5 10.5,20 14.5,16 v14.5,15.5
6B1  (via drill 0.4)
  Top 0.254: T61.1 19.95,35.05 20.5,34.5 v20.5,33.5 | RN80.7 18.6,15.4 v18.5,15.5
  Bottom 0.254: v20.5,33.5 22.5,31.5 22.5,20 18.5,16 v18.5,15.5
6B2  (via drill 0.4)
  Top 0.254: T62.1 23.45,35.05 24,34.5 v24,33.5 | RN80.6 19.4,15.4 v19.5,15.5
  Bottom 0.254: v24,33.5 23,32.5 23,19.5 19.5,16 v19.5,15.5
6B3  (via drill 0.4)
  Top 0.254: T63.1 24.55,29.05 v24,28.5 | RN80.5 20.2,15.2 v20.5,15.5
  Bottom 0.254: v24,28.5 23.5,28 23.5,19 20.5,16 v20.5,15.5
6B4  (via drill 0.4)
  Top 0.254: T64.1 25.1,25.1 v24.5,24.5 | RN71.8 25.3,15.2 v25,15.5
  Bottom 0.254: v24.5,24.5 24,24 24,17 25,16 v25,15.5
6B5  (via drill 0.4)
  Top 0.254: RN71.7 26.1,15.4 v26,15.5 | T65.1 26.45,19.05 v26.5,19
  Bottom 0.254: v26,15.5 26,16 25,17 25,18.5 25.5,19 v26.5,19
6B6  (via drill 0.4)
  Top 0.254: T66.1 8.9,21.9 v9,22 | RN81.8 12.8,15.2 v12.5,15.5
  Bottom 0.254: v9,22 9.5,21.5 9.5,19 12.5,16 v12.5,15.5
6B7  (via drill 0.4)
  Top 0.254: T67.1 8.9,26.9 v9.5,27.5 | RN81.7 13.6,15.4 v13.5,15.5
  Bottom 0.254: v9.5,27.5 10,27 10,19.5 13.5,16 v13.5,15.5
6B8  (via drill 0.4)
  Top 0.254: T68.1 15.95,35.05 16.5,34.5 v16.5,33.5 | RN80.8 17.8,15.2 v17.5,15.5
  Bottom 0.254: v16.5,33.5 11.5,28.5 11.5,21 16,16.5 17,16.5 17.5,16 v17.5,15.5
6B9  (via drill 0.4)
  Top 0.254: T69.1 12.45,35.05 13,34.5 v13,33.5 | RN81.5 15.2,15.2 v15.5,15.5
  Bottom 0.254: v13,33.5 11,31.5 11,20.5 15.5,16 v15.5,15.5
6C
  Top 0.254: IC6.2 43.17,11.68 43.6,12.1 RN60.2
6C0
  Top 0.305: T60.3 13,30 14.5,28.5 14.5,27 15.73,25.77 N6.K0
6C1
  Top 0.305: T61.3 19,31.21 N6.K1
6C2
  Top 0.305: T62.3 22.5,32.5 18.27,28.27 N6.K2
6C3
  Top 0.305: T63.3 21,30 19.5,28.5 19.5,27 18.27,25.77 N6.K3
6C4
  Top 0.305: T64.3 20,26.5 19.5,26 19.5,24.5 18.27,23.27 N6.K4
6C5
  Top 0.305: T65.3 22.9,20.1 22,21 22,23.5 21.5,24 20,24 19.5,23.5 19.5,21.55 N6.K5
6C6
  Top 0.305: T66.3 11.1,20.1 12,21 12,23.5 12.5,24 14,24 14.5,23.5 14.5,21.55 N6.K6
6C7
  Top 0.305: N6.K7 15.73,23.27 14.5,24.5 14.5,26 14,26.5 12.5,26.5 11.5,25.5 T67.3
6C8
  Top 0.305: T68.3 15,31.21 N6.K8
6C9
  Top 0.305: T69.3 11.5,32.5 15.73,28.27 N6.K9
6D
  Top 0.254: IC6.3 41.91,11.4 42.8,12.3 RN60.1
6E
  Top 0.254: IC6.4 40.63,11.87 40.2,12.3 RN61.4
6F
  Top 0.254: IC6.5 39.37,12.66 RN61.3
6G
  Top 0.254: IC6.6 38.09,11.6 38.6,12.1 RN61.2
6H
  Top 0.254: IC6.7 36.83,11.32 37.8,12.3 RN61.1
7A
  Top 0.254: IC7.15 30.68,5.67 33,8 33,12 32.7,12.3 RN70.4
7B
  Top 0.254: IC7.1 31.95,12.65 RN70.3
7C
  Top 0.254: IC7.2 30.68,11.68 31.1,12.1 RN70.2
7D
  Top 0.254: IC7.3 29.41,11.4 30.3,12.3 RN70.1
7E
  Top 0.254: IC7.4 28.14,11.87 27.7,12.3 RN71.4
7F
  Top 0.254: IC7.5 26.86,12.66 RN71.3
7G
  Top 0.254: IC7.6 25.59,11.6 26.1,12.1 RN71.2
7H
  Top 0.254: IC7.7 24.32,11.32 25.3,12.3 RN71.1
8A
  Top 0.254: IC8.15 18.18,5.67 20.5,8 20.5,12 20.2,12.3 RN80.4
8B
  Top 0.254: IC8.1 19.45,12.65 RN80.3
8C
  Top 0.254: IC8.2 18.18,11.68 18.6,12.1 RN80.2
8D
  Top 0.254: IC8.3 16.91,11.4 17.8,12.3 RN80.1
8E
  Top 0.254: IC8.4 15.63,11.87 15.2,12.3 RN81.4
8F
  Top 0.254: IC8.5 14.37,12.66 RN81.3
8G
  Top 0.254: IC8.6 13.1,11.6 13.6,12.1 RN81.2
8H
  Top 0.254: IC8.7 11.82,11.32 12.8,12.3 RN81.1
+5V
  Top 0.406: IC1.16 139.44,3.5 | 139.44,3.5 139.44,2.56 139.39,2.5 127,2.5 | 127,2.5 114.5,2.5 | 114.5,2.5 97.5,2.5 | 97.5,2.5 89.5,2.5 | 89.5,2.5 69.5,2.5 | 69.5,2.5 44.5,2.5 | 44.5,2.5 32,2.5 | 32,2.5 19.5,2.5 19.45,2.56 19.45,3.5 | IC8.16 19.45,3.5 | IC2.16 126.94,3.5 | 126.94,3.5 126.94,2.56 127,2.5 | IC4.16 89.44,3.5 | 89.44,3.5 89.44,2.56 89.5,2.5 | IC5.16 69.44,3.5 | 69.44,3.5 69.44,2.56 69.5,2.5 | IC6.16 44.45,3.5 | 44.45,3.5 44.45,2.56 44.5,2.5 | IC7.16 31.95,3.5 | 31.95,3.5 31.95,2.56 32,2.5 | JP2.6 97.46,2.54 97.5,2.54 97.5,2.5 | C8.1 19.59,3.65 19.45,3.5 | C7.1 32.09,3.65 31.95,3.5 | C6.1 44.59,3.65 44.45,3.5 | C5.1 69.59,3.65 69.44,3.5 | C4.1 89.59,3.65 89.44,3.5 | IC3.16 114.44,3.5 | 114.44,3.5 114.44,2.56 114.5,2.5 | C3.1 114.59,3.65 114.44,3.5 | C2.1 127.09,3.65 126.94,3.5 | C1.1 139.59,3.65 139.44,3.5
EN  (via drill 0.4)
  Top 0.254: IC1.13 135.63,8.37 v135,9 | IC2.13 123.14,8.37 v122.5,9 | IC3.13 110.64,8.37 v110,9 | v85,9 85.64,8.37 IC4.13 | v65,9 65.64,8.37 IC5.13 | v40,9 40.63,8.37 IC6.13 | IC7.13 28.14,8.37 v27.5,9 | IC8.13 15.63,8.37 v15,9 | JP1.1 53.96,10.04 v54,10
  Bottom 0.254: v135,9 v122.5,9 v110,9 v85,9 v65,9 54,9 | v15,9 v27.5,9 v40,9 54,9 | v54,10 54,9
GL1  (via drill 0.4)
  Top 0.254: RN31.5 110.2,15.2 v110.5,15.5 | T1.1 101.95,31.55 102.5,31 v102.5,30
  Bottom 0.254: v110.5,15.5 110.5,16 110,16.5 108,16.5 104,20.5 104,28.5 v102.5,30
GL2  (via drill 0.4)
  Top 0.254: RN31.6 109.4,15.4 v109.5,15.5 | T2.1 97.95,31.55 98.5,31 v98.5,30
  Bottom 0.254: v109.5,15.5 109,16 107.5,16 103.5,20 103.5,27.5 101,30 v98.5,30
GL3  (via drill 0.4)
  Top 0.254: RN60.7 43.6,15.4 v43.5,15.5 | T3.1 53.95,31.55 54.5,31 v54.5,30
  Bottom 0.254: v43.5,15.5 44,16 54.5,16 56,17.5 56,28.5 v54.5,30
GL4  (via drill 0.4)
  Top 0.254: RN60.8 42.8,15.2 v42.5,15.5 | v50.5,30 50.5,31 49.95,31.55 T4.1
  Bottom 0.254: v42.5,15.5 42.5,16 43,16.5 54,16.5 55.5,18 55.5,27.5 53,30 v50.5,30
GND  (via drill 0.4)
  Top 0.406: C6.2 47.5,5.35 47.5,5
  other vias: 102,27 102,19 96,19 96,27 123,21 123,31 105.5,12.5 118,12.5 130.5,12.5 80.5,12.5 60.5,12.5 35.5,12.5 23,12.5 10.5,12.5 48.5,4.5 54,27 54,19 48,19 48,27 27,21 27,31 142,40 140,40 138,40 136,40 134,40 132,40 130,40 128,40 126,40 124,40 122,40 120,40 118,40 116,40 114,40 112,40 110,40 108,40 106,40 104,40 102,40 100,40 98,40 96,40 94,40 92,40 90,40 88,40 86,40 84,40 82,40 80,40 78,40 76,40 74,40 72,40 70,40 68,40 66,40 64,40 62,40 60,40 58,40 56,40 54,40 52,40 50,40 48,40 46,40 44,40 42,40 40,40 38,40 36,40 34,40 32,40 30,40 28,40 26,40 24,40 22,40 20,40 18,40 16,40 14,40 12,40 10,40 8,40 142,1 140,1 138,1 136,1 134,1 132,1 130,1 128,1 126,1 124,1 122,1 120,1 118,1 116,1 114,1 112,1 110,1 108,1 106,1 104,1 102,1 100,1 98,1 96,1 94,1 92,1 90,1 88,1 86,1 84,1 82,1 80,1 78,1 76,1 74,1 72,1 70,1 68,1 66,1 64,1 62,1 60,1 58,1 56,1 54,1 52,1 50,1 48,1 46,1 44,1 42,1 40,1 38,1 36,1 34,1 32,1 30,1 28,1 26,1 24,1 22,1 20,1 18,1 16,1 14,1 12,1 10,1 8,1 148,34 148,32 148,30 148,28 148,26 148,24 148,22 148,20 148,18 148,16 148,14 148,12 148,10 148,8 2,34 2,32 2,30 2,28 2,26 2,24 2,22 2,20 2,18 2,16 2,14 2,12 2,10 2,8 72.5,12.5 48,13 92.5,12.5
  pour Top (isolate 0.61): 147,0 150,3 150,39 148,42 3,42 0,39 0,3 3,0
  pour Bottom (isolate 0.61): 147,0 150,3 150,39.5 147,42 3,42 0,39 0,3 3,0
MOSI  (via drill 0.4)
  Top 0.254: IC1.14 136.91,8.4 v137,8.5 | JP1.4 50,6 52,8 54,8 v56,10
  Bottom 0.254: v56,10 135.5,10 v137,8.5
N1_0
  Top 0.305: T10.3 129,30 130.5,28.5 130.5,27 131.73,25.77 N1.K0
N1_1
  Top 0.305: T11.3 135,31.21 N1.K1
N1_2
  Top 0.305: T12.3 138.5,32.5 134.27,28.27 N1.K2
N1_3
  Top 0.305: T13.3 137,30 135.5,28.5 135.5,27 134.27,25.77 N1.K3
N1_4
  Top 0.305: T14.3 136,26.5 135.5,26 135.5,24.5 134.27,23.27 N1.K4
N1_5
  Top 0.254: 137.5,24 138,23.5 138,20.9 T15.3
  Top 0.305: 137.5,24 136,24 135.5,23.5 135.5,21.55 N1.K5
N1_6
  Top 0.305: N1.K6 130.5,21.55 130.5,23.5 130,24 128.5,24 128,23.5 128,21 127.1,20.1 T16.3
N1_7
  Top 0.305: N1.K7 131.73,23.27 130.5,24.5 130.5,26 130,26.5 128.5,26.5 127.5,25.5 T17.3
N1_8
  Top 0.305: T18.3 131,31.21 N1.K8
N1_9
  Top 0.305: T19.3 127.5,32.5 131.73,28.27 N1.K9
N1_PR
  Top 0.254: R11.2 139,23.5 137.1,25.4 N1.PR
N2_0
  Top 0.305: T20.3 109,30 110.5,28.5 110.5,27 111.73,25.77 N2.K0
N2_1
  Top 0.305: T21.3 115,31.21 N2.K1
N2_2
  Top 0.305: T22.3 118.5,32.5 114.27,28.27 N2.K2
N2_3
  Top 0.305: T23.3 117,30 115.5,28.5 115.5,27 114.27,25.77 N2.K3
N2_4
  Top 0.305: T24.3 116,26.5 115.5,26 115.5,24.5 114.27,23.27 N2.K4
N2_5
  Top 0.305: T25.3 118.9,20.1 118,21 118,23.5 117.5,24 116,24 115.5,23.5 115.5,21.55 N2.K5
N2_6
  Top 0.305: T26.3 107.1,20.1 108,21 108,23.5 108.5,24 110,24 110.5,23.5 110.5,21.55 N2.K6
N2_7
  Top 0.305: N2.K7 111.73,23.27 110.5,24.5 110.5,26 110,26.5 108.5,26.5 107.5,25.5 T27.3
N2_8
  Top 0.305: T28.3 111,31.21 N2.K8
N2_9
  Top 0.305: T29.3 107.5,32.5 111.73,28.27 N2.K9
N3_0
  Top 0.305: T30.3 81,30 82.5,28.5 82.5,27 83.73,25.77 N3.K0
N3_1
  Top 0.305: T31.3 87,31.21 N3.K1
N3_2
  Top 0.305: T32.3 90.5,32.5 86.27,28.27 N3.K2
N3_3
  Top 0.305: T33.3 89,30 87.5,28.5 87.5,27 86.27,25.77 N3.K3
N3_4
  Top 0.305: T34.3 88,26.5 87.5,26 87.5,24.5 86.27,23.27 N3.K4
N3_5
  Top 0.305: T35.3 90.9,20.1 90,21 90,23.5 89.5,24 88,24 87.5,23.5 87.5,21.55 N3.K5
N3_6
  Top 0.305: T36.3 79.1,20.1 80,21 80,23.5 80.5,24 82,24 82.5,23.5 82.5,21.55 N3.K6
N3_7
  Top 0.305: N3.K7 83.73,23.27 82.5,24.5 82.5,26 82,26.5 80.5,26.5 79.5,25.5 T37.3
N3_8
  Top 0.305: T38.3 83,31.21 N3.K8
N3_9
  Top 0.305: T39.3 79.5,32.5 83.73,28.27 N3.K9
N$1
  Top 0.305: R2.1 GL2.1
N$2
  Top 0.305: R3.1 GL3.1
N$3
  Top 0.305: R4.1 GL4.1
N$4
  Top 0.406: N1.A1 136.81,20.31 135,18.5 131.5,18.5 130.15,19.85 R10.1 129.19,19.66 N1.A2
N$5
  Top 0.305: GL2.2 98,27.5 97,28.5 T2.3
N$6
  Top 0.305: GL1.2 100,27.5 101,28.5 T1.3
N$7
  Top 0.305: GL4.2 50,27.5 49,28.5 T4.3
N$8
  Top 0.305: GL3.2 52,27.5 53,28.5 T3.3
N$9
  Top 0.406: N2.A1 116.81,20.31 115,18.5 111.5,18.5 110.15,19.85 R20.1 109.19,19.66 N2.A2
N$10  (via drill 0.4)
  Top 0.254: IC1.9 130.56,6.05 v131,6.5 | v125,6.5 124.41,5.91 IC2.14
  Bottom 0.254: v131,6.5 130.5,7 125.5,7 v125,6.5
N$11  (via drill 0.4)
  Top 0.254: IC3.14 111.91,5.91 v112.5,6.5 | IC2.9 118.06,6.05 v118.5,6.5
  Bottom 0.254: v112.5,6.5 113,7 118,7 v118.5,6.5
N$12  (via drill 0.4)
  Top 0.254: IC3.9 105.56,6.05 v106,6.5 | v87.5,6.5 86.91,5.91 IC4.14
  Bottom 0.254: v106,6.5 105.5,7 88,7 v87.5,6.5
N$13
  Top 0.406: N3.A1 88.81,20.31 87,18.5 83.5,18.5 82.15,19.85 R30.1 81.19,20.16 N3.A2
N$14
  Top 0.406: N4.A1 68.81,20.31 67,18.5 63.5,18.5 62.15,19.85 R40.1 61.19,20.16 N4.A2
N$15  (1 unrouted)
  Top 0.406: N6.A2 13.19,20.31 13.5,20 | N6.A1 20.81,20.31 19,18.5 15.5,18.5 14.15,19.85 R60.1
N$16  (via drill 0.4)
  Top 0.254: IC4.9 80.56,6.05 v81,6.5 | IC5.14 66.91,5.91 v67.5,6.5
  Bottom 0.254: v81,6.5 80.5,7 68,7 v67.5,6.5
N$17
  Top 0.406: N5.A1 40.81,20.31 39,18.5 35.5,18.5 34.15,19.85 R50.1 33.19,20.16 N5.A2
N$18  (via drill 0.4)
  Top 0.254: IC5.9 60.55,6.05 v61,6.5 | v42.5,6.5 41.91,5.91 IC6.14
  Bottom 0.254: v61,6.5 60.5,7 54,7 53,6 46,6 45,7 43,7 v42.5,6.5
N$19  (via drill 0.4)
  Top 0.254: IC7.14 29.41,5.91 v30,6.5 | IC6.9 35.55,6.05 v36,6.5
  Bottom 0.254: v36,6.5 35.5,7 30.5,7 v30,6.5
N$20  (via drill 0.4)
  Top 0.254: IC7.9 23.05,6.05 v23.5,6.5 | IC8.14 16.91,5.91 v17.5,6.5
  Bottom 0.254: v23.5,6.5 23,7 18,7 v17.5,6.5
N$21
  Top 0.305: GL1.1 R1.1
N$25
  Top 0.305: R61.2 23.5,23 21.1,25.4 N6.PR
N$26
  Top 0.305: R31.2 91,23.5 89.1,25.4 N3.PR
N$27
  Top 0.305: R21.2 119,23.5 117.1,25.4 N2.PR
N$28
  Top 0.305: R51.2 43.5,23 41.1,25.4 N5.PR
N$29
  Top 0.305: R41.2 71.5,23 69.1,25.4 N4.PR
RCK  (via drill 0.4)
  Top 0.254: IC1.12 134.37,7.63 v134,8 | IC2.12 121.86,7.63 v121.5,8 | IC3.12 109.36,7.63 v109,8 | IC4.12 84.36,7.63 v84,8 | IC5.12 64.36,7.63 v64,8 | IC6.12 39.37,7.63 v39,8 | IC7.12 26.86,7.63 v26.5,8 | IC8.12 14.37,7.63 v14,8 | JP1.5 47.46,8.04 v47.5,8
  Bottom 0.254: v134,8 133.5,8.5 123.5,8.5 123,8 v121.5,8 121,8.5 111,8.5 110.5,8 v109,8 108.5,8.5 86,8.5 85.5,8 v84,8 83.5,8.5 66,8.5 65.5,8 v64,8 63.5,8.5 47.5,8.5 | v14,8 15.5,8 16,8.5 26,8.5 v26.5,8 28,8 28.5,8.5 38.5,8.5 v39,8 40.5,8 41,8.5 47.5,8.5 | v47.5,8 47.5,8.5
SCK  (via drill 0.4)
  Top 0.254: IC1.11 133.09,7.41 v133,7.5 | IC2.11 120.59,7.41 v120.5,7.5 | IC3.11 108.09,7.41 v108,7.5 | IC4.11 83.09,7.41 v83,7.5 | IC5.11 63.09,7.41 v63,7.5 | IC6.11 38.09,7.41 v38,7.5 | IC7.11 25.59,7.41 v25.5,7.5 | IC8.11 13.1,7.41 v13,7.5 | JP1.3 v50,7.5
  Bottom 0.254: v133,7.5 132.5,8 124,8 123,7 121,7 v120.5,7.5 120,8 111.5,8 110.5,7 108.5,7 v108,7.5 107.5,8 86.5,8 85.5,7 83.5,7 v83,7.5 82.5,8 66.5,8 65.5,7 63.5,7 v63,7.5 62.5,8 50.5,8 v50,7.5 49.5,7 47,7 46,8 41.5,8 40.5,7 38.5,7 v38,7.5 37.5,8 29,8 28,7 26,7 v25.5,7.5 25,8 16.5,8 15.5,7 13.5,7 v13,7.5
SCL  (via drill 0.4)
  Top 0.254: IC1.10 131.82,6.83 v132,7 | IC2.10 119.33,6.83 v119.5,7 | IC3.10 106.83,6.83 v107,7 | IC4.10 81.83,6.83 v82,7 | IC5.10 61.83,6.83 v62,7 | IC6.10 36.83,6.83 v37,7 | IC7.10 24.32,6.83 v24.5,7 | IC8.10 11.82,6.83 v12,7 | JP1.2 52.54,6.96 v52.5,7
  Bottom 0.254: v132,7 131.5,7.5 124.5,7.5 123.5,6.5 120,6.5 v119.5,7 119,7.5 112,7.5 111,6.5 107.5,6.5 v107,7 106.5,7.5 87,7.5 86,6.5 82.5,6.5 v82,7 81.5,7.5 67,7.5 66,6.5 62.5,6.5 v62,7 61.5,7.5 53,7.5 v52.5,7 52,6.5 46.5,6.5 45.5,7.5 42,7.5 41,6.5 37.5,6.5 v37,7 36.5,7.5 29.5,7.5 28.5,6.5 25,6.5 v24.5,7 24,7.5 17,7.5 16,6.5 12.5,6.5 v12,7
VDD  (2 unrouted)
  Top 0.406: R10.2 129.5,17 109.5,17 | 109.5,18 R20.2 109.5,17 | 99,17 102.5,17 | 102.5,17 109.5,17 | 99,17 81.5,17 | 81.5,17 61.5,17 | R30.2 81.5,17 | R40.2 61.5,17 | 61.5,17 51,17 | 51,17 33.5,17 | 33.5,17 14,17 13.5,17.5 R60.2 | R50.2 33.5,17 | R1.2 99,19.65 | 99,19.65 98.15,19.65 98,19.5 | 99,17 99,19.65 | R3.2 51,19.65 | 51,19.65 50.15,19.65 50,19.5 | 51,17 51,19.65 | JP2.1 102.5,10.04 102.5,17